# EAGLE design NinjaPCB_ver2-170831 (EAGLE 6.6.0)
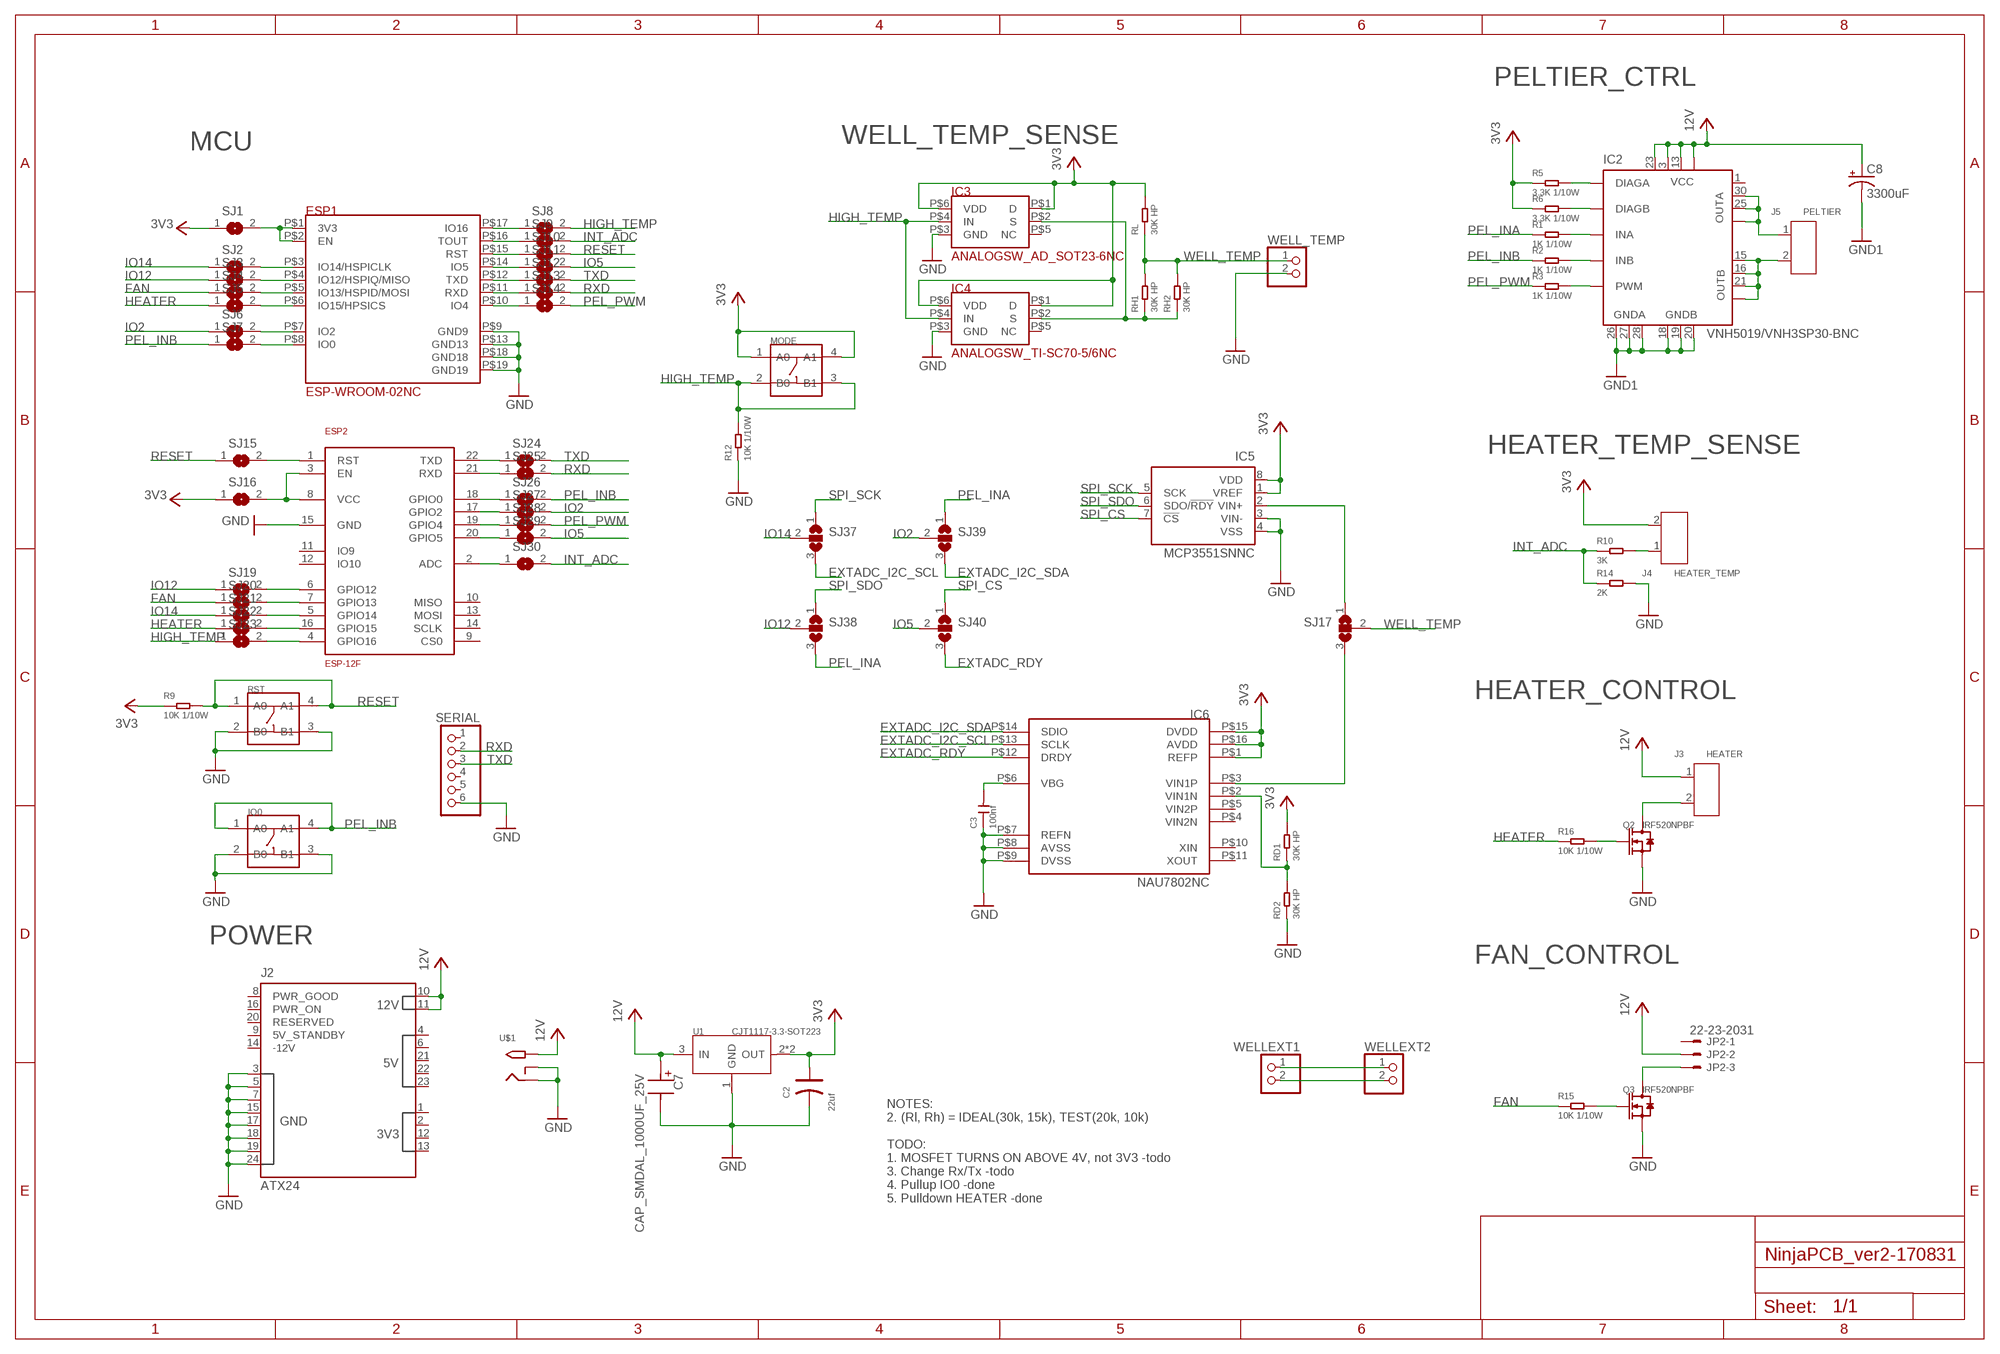
[diagram p0: schematic, sheet 1]

## Parts
C2  22uf  TANTALUM-SMD-22UF-16V(AVX-B)  [AVX-B]
C3  100nf  CERAMIC-100NF-50V-10%-X7R(0603)  [C0603]
C7  CAP_SMDAL_1000UF_25V  [CAP_SMD_AL_D125]
C8  3300uF  CAP_E5-13-L3030RINV  [E5-13-L30R-INV]
ESP1  ESP-WROOM-02NC  [ESP-WROOM-02-NOCREAM]
ESP2  ESP-12F  [ESP-12F]
IC2  VNH5019/VNH3SP30-BNC  [MULTIPOWERSO-30-B-NOCREAM]
IC3  ANALOGSW_AD_SOT23-6NC  [SOT-23-6NC]
IC4  ANALOGSW_TI-SC70-5/6NC  [SC70-6NC]
IC5  MCP3551SNNC  [SO-08-NOCREAM]
IC6  NAU7802NC  [SOP-16NC]
IO0  DIP-SWITCH-TACTILE-SPST-NO/TS-1109(4P-D6.0MM)'TS-1109'  [SW4-6.0X6.0X5.0MM]
J2  ATX24  [ATX24]
J3  HEATER  SCREW-TERMINAL-GREEN(2P-3.5)  [H2-3.5-7.0X7.0MM]
J4  HEATER_TEMP  SCREW-TERMINAL-GREEN(2P-3.5)  [H2-3.5-7.0X7.0MM]
J5  PELTIER  SCREW-TERMINAL-GREEN(2P-3.5)  [H2-3.5-7.0X7.0MM]
JP2  22-23-2031  [22-23-2031]
MODE  DIP-SWITCH-TACTILE-SPST-NO/TS-1109(4P-D6.0MM)'TS-1109'  [SW4-6.0X6.0X5.0MM]
Q2  IRF520NPBF  DIP-MOSFET-N-CH-100V-9.7A-IRF520NPBF(TO-220AB)  [TO-220]
Q3  IRF520NPBF  DIP-MOSFET-N-CH-100V-9.7A-IRF520NPBF(TO-220AB)  [TO-220]
R1  1K 1/10W  SMD-RES-1K-5%-1/10W(0603)  [R0603]
R2  1K 1/10W  SMD-RES-1K-5%-1/10W(0603)  [R0603]
R3  1K 1/10W  SMD-RES-1K-5%-1/10W(0603)  [R0603]
R5  3.3K 1/10W  SMD-RES-3.3K-5%-1/10W(0603)  [R0603]
R6  3.3K 1/10W  SMD-RES-3.3K-5%-1/10W(0603)  [R0603]
R9  10K 1/10W  SMD-RES-10K-5%-1/10W(0603)  [R0603]
R10  3K  SMD-RES-3K-1%-1/10W(0603)  [R0603]
R12  10K 1/10W  SMD-RES-10K-5%-1/10W(0603)  [R0603]
R14  2K  SMD-RES-2K-1%-1/10W(0603)  [R0603]
R15  10K 1/10W  SMD-RES-10K-5%-1/10W(0603)  [R0603]
R16  10K 1/10W  SMD-RES-10K-5%-1/10W(0603)  [R0603]
RD1  30K HP  R0603NC  [R0603NC]
RD2  30K HP  R0603NC  [R0603NC]
RH1  30K HP  R0603NC  [R0603NC]
RH2  30K HP  R0603NC  [R0603NC]
RL  30K HP  R0603NC  [R0603NC]
RST  DIP-SWITCH-TACTILE-SPST-NO/TS-1109(4P-D6.0MM)'TS-1109'  [SW4-6.0X6.0X5.0MM]
SERIAL  PINHD-1X6  [1X06]
SJ1  SJ  [SJ]
SJ2  SJ  [SJ]
SJ3  SJ  [SJ]
SJ4  SJ  [SJ]
SJ5  SJ  [SJ]
SJ6  SJ  [SJ]
SJ7  SJ  [SJ]
SJ8  SJ  [SJ]
SJ9  SJ  [SJ]
SJ10  SJ  [SJ]
SJ11  SJ  [SJ]
SJ12  SJ  [SJ]
SJ13  SJ  [SJ]
SJ14  SJ  [SJ]
SJ15  SJ  [SJ]
SJ16  SJ  [SJ]
SJ17  SJ2W  [SJ_2]
SJ19  SJ  [SJ]
SJ20  SJ  [SJ]
SJ21  SJ  [SJ]
SJ22  SJ  [SJ]
SJ23  SJ  [SJ]
SJ24  SJ  [SJ]
SJ25  SJ  [SJ]
SJ26  SJ  [SJ]
SJ27  SJ  [SJ]
SJ28  SJ  [SJ]
SJ29  SJ  [SJ]
SJ30  SJ  [SJ]
SJ37  SJ2W  [SJ_2]
SJ38  SJ2W  [SJ_2]
SJ39  SJ2W  [SJ_2]
SJ40  SJ2W  [SJ_2]
U1  CJT1117-3.3-SOT223  PMIC-CJT1117-3.3(SOT223)  [SOT-223]
U$1  2.1MMJACKTHM  [PJ-102A]
WELL_TEMP  PINHD-1X2  [1X02]
WELLEXT1  PINHD-1X2  [1X02]
WELLEXT2  PINHD-1X2  [1X02]

## Nets
3V3: C2.+ IC3.P$1(D) IC3.P$6(VDD) IC4.P$1(D) IC4.P$6(VDD) IC5.1(VREF) IC5.8(VDD) IC6.P$1(REFP) IC6.P$15(DVDD) IC6.P$16(AVDD) J4.2 MODE.1(A0) MODE.4(A1) R5.1 R6.1 R9.1 RD1.2 RL.2 SJ1.1 SJ16.1 U1.2(OUT) U1.TER(OUT)
12V: C7.P$P C8.+ IC2.3(VCC) IC2.13(VCC) IC2.23(VCC) IC2.VCC J2.10(12V_10) J2.11(12V_11) J3.1 JP2.2 U1.3(IN) U$1.TIP
EXTADC_I2C_SCL: IC6.P$13(SCLK) SJ37.3
EXTADC_I2C_SDA: IC6.P$14(SDIO) SJ39.3
EXTADC_RDY: IC6.P$12(DRDY) SJ40.3
FAN: R15.1 SJ4.1 SJ20.1
GND: C2.- C3.1 C7.P$M C8.- ESP1.P$9(GND9) ESP1.P$13(GND13) ESP1.P$18(GND18) ESP1.P$19(GND19) ESP2.15(GND) IC2.18(GNDB) IC2.19(GNDB) IC2.20(GNDB) IC2.26(GNDA) IC2.27(GNDA) IC2.28(GNDA) IC3.P$3(GND) IC4.P$3(GND) IC5.3(VIN-) IC5.4(VSS) IC6.P$7(REFN) IC6.P$8(AVSS) IC6.P$9(DVSS) IO0.2(B0) IO0.3(B1) J2.3(GND3) J2.5(GND5) J2.7(GND7) J2.15(GND15) J2.17(GND17) J2.18(GND18) J2.19(GND19) J2.24(GND24) Q2.2(S) Q2.HEAT(S) Q3.2(S) Q3.HEAT(S) R12.1 R14.2 RD2.1 RST.2(B0) RST.3(B1) SERIAL.6 U1.1(GND) U$1.RING U$1.RING_SW WELL_TEMP.2 ; supply symbol labelled GND1
HEATER: R16.1 SJ5.1 SJ22.1
HIGH_TEMP: IC3.P$4(IN) IC4.P$4(IN) MODE.2(B0) MODE.3(B1) R12.2 SJ8.2 SJ23.1
I2C_WELL_TEMP: IC6.P$3(VIN1P) SJ17.3
INT_ADC: R10.1 R14.1 SJ9.2 SJ30.2
IO2: SJ6.1 SJ27.2 SJ39.2
IO5: SJ11.2 SJ29.2 SJ40.2
IO12: SJ3.1 SJ19.1 SJ38.2
IO14: SJ2.1 SJ21.1 SJ37.2
N$1: J4.1 R10.2
N$2: J3.2 Q2.3(D)
N$3: Q2.1(G) R16.2
N$4: JP2.3 Q3.3(D)
N$5: Q3.1(G) R15.2
N$6: IC2.6(DIAGA) R5.2
N$7: IC2.10(DIAGB) R6.2
N$8: IC2.5(INA) R1.2
N$9: IC2.11(INB) R2.2
N$10: IC2.8(PWM) R3.2
N$11: ESP1.P$1(3V3) ESP1.P$2(EN) SJ1.2
N$12: ESP1.P$3(IO14/HSPICLK) SJ2.2
N$13: ESP1.P$4(IO12/HSPIQ/MISO) SJ3.2
N$14: ESP1.P$5(IO13/HSPID/MOSI) SJ4.2
N$15: ESP1.P$6(IO15/HPSICS) SJ5.2
N$16: ESP1.P$7(IO2) SJ6.2
N$17: ESP1.P$8(IO0) SJ7.2
N$18: ESP1.P$17(IO16) SJ8.1
N$19: ESP1.P$16(TOUT) SJ9.1
N$20: ESP1.P$15(RST) SJ10.1
N$21: ESP1.P$14(IO5) SJ11.1
N$22: ESP1.P$12(TXD) SJ12.1
N$23: ESP1.P$11(RXD) SJ13.1
N$24: ESP1.P$10(IO4) SJ14.1
N$26: WELLEXT1.1 WELLEXT2.1
N$27: IC3.P$2(S) IC4.P$2(S) RH1.1 RH2.1
N$28: WELLEXT1.2 WELLEXT2.2
N$40: ESP2.1(RST) SJ15.2
N$42: ESP2.3(EN) ESP2.8(VCC) SJ16.2
N$43: ESP2.22(TXD) SJ24.1
N$44: ESP2.21(RXD) SJ25.1
N$45: ESP2.18(GPIO0) SJ26.1
N$46: ESP2.17(GPIO2) SJ27.1
N$47: ESP2.19(GPIO4) SJ28.1
N$48: ESP2.20(GPIO5) SJ29.1
N$49: ESP2.2(ADC) SJ30.1
N$67: ESP2.6(GPIO12) SJ19.2
N$68: ESP2.7(GPIO13) SJ20.2
N$69: ESP2.5(GPIO14) SJ21.2
N$70: ESP2.16(GPIO15) SJ22.2
N$71: ESP2.4(GPIO16) SJ23.2
N$91: IC6.P$2(VIN1N) RD1.1 RD2.2
N$92: C3.2 IC6.P$6(VBG)
OUTA: IC2.25(OUTA) IC2.30(OUTA) IC2.OUTA J5.1
OUTB: IC2.15(OUTB) IC2.16(OUTB) IC2.21(OUTB) IC2.OUTB J5.2
PEL_INA: R1.1 SJ38.3 SJ39.1
PEL_INB: IO0.1(A0) IO0.4(A1) R2.1 SJ7.1 SJ26.2
PEL_PWM: R3.1 SJ14.2 SJ28.2
RESET: R9.2 RST.1(A0) RST.4(A1) SJ10.2 SJ15.1
RXD: SERIAL.2 SJ13.2 SJ25.2
SPI_CS: IC5.7(!CS) SJ40.1
SPI_SCK: IC5.5(SCK) SJ37.1
SPI_SDO: IC5.6(SDO/!RDY) SJ38.1
SPI_WELL_TEMP: IC5.2(VIN+) SJ17.1
TXD: SERIAL.3 SJ12.2 SJ24.2
WELL_TEMP: RH1.2 RH2.2 RL.1 SJ17.2 WELL_TEMP.1
Unconnected: ESP2.9(CS0) ESP2.10(MISO) ESP2.11(IO9) ESP2.12(IO10) ESP2.13(MOSI) ESP2.14(SCLK) IC2.1(OUTA) IC3.P$5(NC) IC4.P$5(NC) IC6.P$4(VIN2N) IC6.P$5(VIN2P) IC6.P$10(XIN) IC6.P$11(XOUT) J2.1(3V3_1) J2.2(3V3_2) J2.4(5V_4) J2.6(5V_6) J2.8(PWR_GOOD) J2.9(5V_STANDBY) J2.12(3V3_12) J2.13(3V3_13) J2.14(-12V) J2.16(PWR_ON) J2.20(RESERVED) J2.21(5V_21) J2.22(5V_22) J2.23(5V_23) JP2.1 SERIAL.1 SERIAL.4 SERIAL.5

## Notes on the sheet
- PELTIER_CTRL
- MCU | WELL_TEMP_SENSE
- HEATER_TEMP_SENSE
- HEATER_CONTROL
- POWER
- FAN_CONTROL
- NOTES: 
  2. (Rl, Rh) = IDEAL(30k, 15k), TEST(20k, 10k)
  
  TODO:
  1. MOSFET TURNS ON ABOVE 4V, not 3V3 -todo
  3. Change Rx/Tx -todo
  4. Pullup IO0 -done
  5. Pulldown HEATER -done

## Library data of the parts
C2 = Seeed-Capacitor:TANTALUM-SMD-22UF-16V(AVX-B): 302020013; MPN: TAJB226*016#NJ
C3 = Seeed-Capacitor:CERAMIC-100NF-50V-10%-X7R(0603): 302010138; MPN: CC0603KRX7R9BB104
C7 = Seeed-OPL-2017-01-Capacitor-akita:CAP_SMDAL_1000UF_25V: SMD CAP Aluminum 1000uF-25V;D12.5*H13.5mm SKU: 302030098
C8 = PCR-RCL:CAP_E5-13-L30
ESP1 = PCR-Module:ESP-WROOM-02
ESP2 = Seeed-OPL-2017-01-Sensor-camilo:ESP-12F: 317060163
IC2 = st-microelectronics:VNH5019/VNH3SP30-B
IC3 = PCR-IC:ANALOGSW_AD_SOT23-6
IC4 = PCR-IC:ANALOGSW_TI-SC70-5/6
IC5 = microchip:MCP355*: Low-Power, Single-Channel 22-Bit Delta-Sigma ADCs Source: http://ww1.microchip.com/downloads/en/DeviceDoc/21950c.pdf
IC6 = PCR-IC:NAU7802
IO0 MODE RST = Seeed-Switch:DIP-SWITCH-TACTILE-SPST-NO/TS-1109(4P-D6.0MM): 311020024
J2 = PCR-Connector:ATX24
J3-J5 = Seeed-Connector:SCREW-TERMINAL-GREEN(2P-3.5): 320110028; VALUE: GREEN-2P-3.5
JP2 = con-molex:22-23-2031: .100" (2.54mm) Center Header - 3 Pin; MF: MOLEX; MPN: 22-23-2031; OC_FARNELL: 1462950; OC_NEWARK: 30C0862
Q2 Q3 = Seeed-Transistor:DIP-MOSFET-N-CH-100V-9.7A-IRF520NPBF(TO-220AB): 305030059; MPN: IRF520NPBF
R1-R3 = Seeed-Resistor:SMD-RES-1K-5%-1/10W(0603): 301010291; MPN: RC0603JR-071KL
R5 R6 = Seeed-Resistor:SMD-RES-3.3K-5%-1/10W(0603): 301010112
R9 R12 R15 R16 = Seeed-Resistor:SMD-RES-10K-5%-1/10W(0603): 301010293; MPN: RC0603JR-0710KL
R10 = Seeed-Resistor:SMD-RES-3K-1%-1/10W(0603): 301010170; MPN: RC0603FR-073KL
R14 = Seeed-Resistor:SMD-RES-2K-1%-1/10W(0603): 301010221; MPN: RC0603FR-072KL
RD1 RD2 RH1 RH2 RL = PCR-RCL:R0603
SERIAL = pinhead:PINHD-1X6: PIN HEADER
SJ1-SJ16 SJ19-SJ30 = jumper:SJ: SMD solder JUMPER
SJ17 SJ37-SJ40 = jumper:SJ2W: SMD solder JUMPER
U1 = Seeed-IC:PMIC-CJT1117-3.3(SOT223): 310030097; MPN: CJT1117-3.3
U$1 = adafruit:2.1MMJACK: 2.1mm x 5.5mm THM DC jack with internal switch. Digikey part #PJ-102A, 4UCON part #05537 2.1mm x 5.5mm SMT DC jack with internal switch. Digikey part #PJ-002A-SMT, 4UCON part #03267 By microbuilder.eu & adafruit.com
WELL_TEMP WELLEXT1 WELLEXT2 = pinhead:PINHD-1X2: PIN HEADER

## Net classes
1 2A: width 0.406 mm
2 8A: width 2.54 mm

## Board
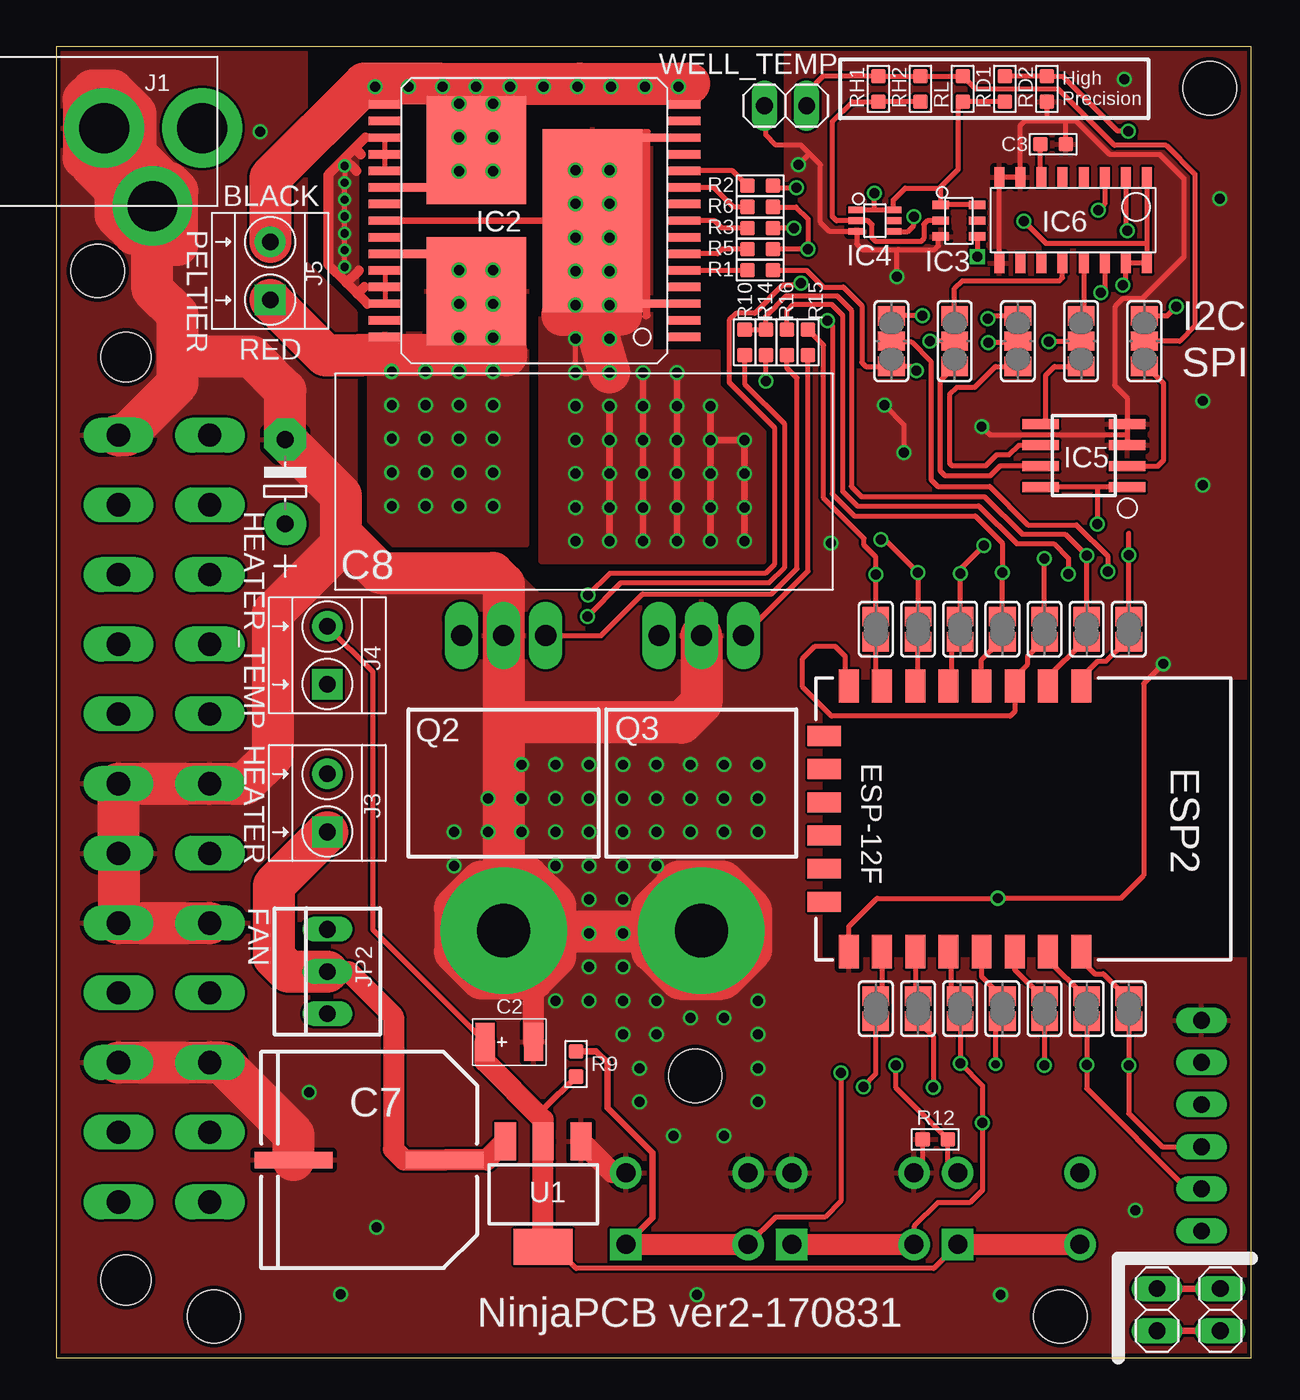
[diagram p1: board, top side]
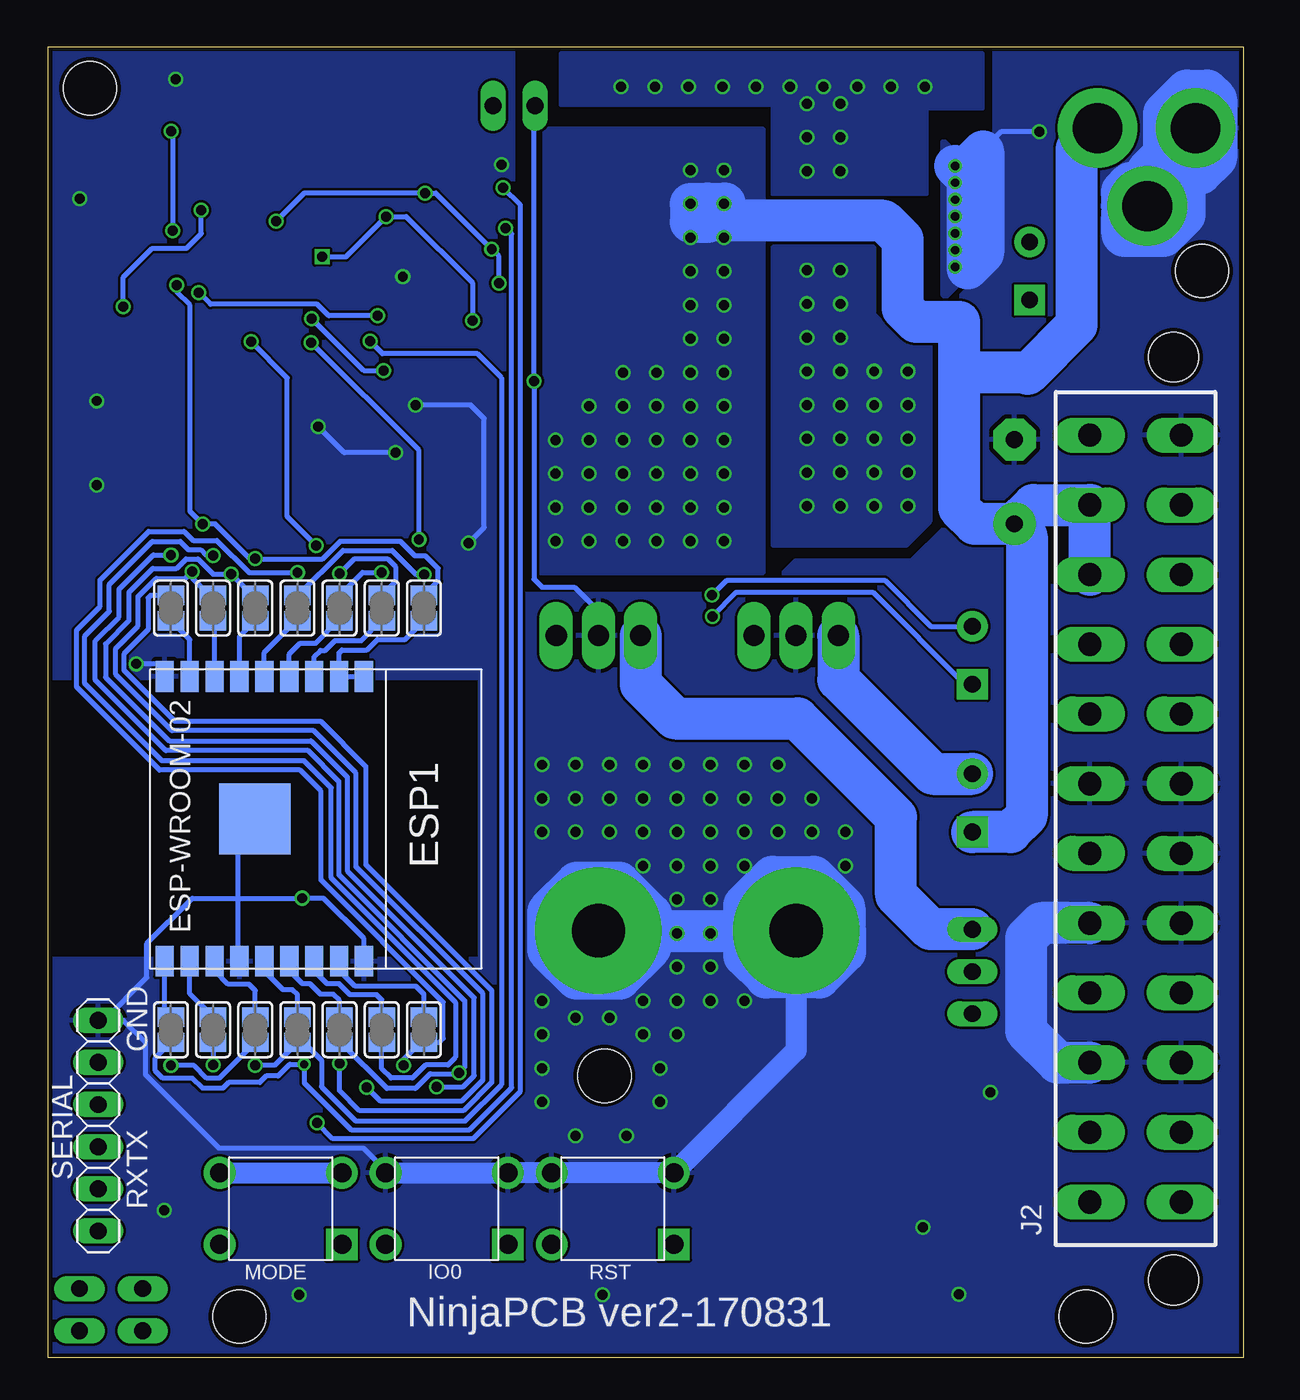
[diagram p2: board, bottom side, seen from below]

Size 72 x 79 mm. Coordinates in mm from the lower left corner, seen from the top.
Outline: 0,79 0,0 72,0 72,79 0,79
Copper layers (1*16): Top 0.035mm / dielectric 1.5mm / Bottom 0.035mm
Design rules "SeeedStudio_2layer_DRU_no_angle_20140221": minimum track width 6mil, minimum drill 12mil, track to track 6mil, track to pad 6mil, pad to pad 6mil, via to via 6mil, smd to smd 0mil, copper to edge 10mil, drill to drill 10mil, minimum pad ring 10mil, minimum via ring 6mil, stop-mask expansion 2mil, vias tented up to drill 100mil, thermal gap 10mil
Holes 3.2 mm at 2.5,65.5 69.5,76.5 60.5,2.5 38.5,17 9.5,2.5

### Footprints (pad centres in the part's own frame; a part is rotated, then mirrored left to right if it is on the bottom)
AVX-B = smd 1.143 x 2.286: + -1.46,0; - 1.46,0
C0603 = smd 0.889 x 0.889: 1 0,0.762; 2 0,-0.762
CAP_SMD_AL_D125 = smd 1 x 4.7: P$M 0,-4.55; P$P 0,4.55
E5-13-L30R-INV = drill 1.016 pad 2.54: + 2.54,0 | drill 1.016 pad 2.54 octagon: - -2.54,0
ESP-WROOM-02-NOCREAM = smd 1.85 x 1.1: P$1 -8.575,12.9; P$2 -8.575,11.4; P$3 -8.575,9.9; P$4 -8.575,8.4; P$5 -8.575,6.9; P$6 -8.575,5.4; P$7 -8.575,3.9; P$8 -8.575,2.4; P$9 -8.575,0.9; P$10 8.575,0.9; P$11 8.575,2.4; P$12 8.575,3.9; P$13 8.575,5.4; P$14 8.575,6.9; P$15 8.575,8.4; P$16 8.575,9.9; P$17 8.575,11.4; P$18 8.575,12.9 | smd 4.3 x 4.3: P$19 0,6.33
ESP-12F = smd 2 x 1.2: 1 -8,3.48; 2 -8,1.48; 3 -8,-0.52; 4 -8,-2.52; 5 -8,-4.52; 6 -8,-6.52; 7 -8,-8.52; 8 -8,-10.52; 15 8,-10.52; 16 8,-8.52; 17 8,-6.52; 18 8,-4.52; 19 8,-2.52; 20 8,-0.52; 21 8,1.48; 22 8,3.48 | smd 1.2 x 2: 9 -5,-12; 10 -3,-12; 11 -1,-12; 12 1,-12; 13 3,-12; 14 5,-12
MULTIPOWERSO-30-B-NOCREAM = smd 0.508 x 2: 1 -7,-9; 2 -6,-9; 4 -4,-9; 5 -3,-9; 6 -2,-9; 7 -1,-9; 8 0,-9; 9 1,-9; 10 2,-9; 11 3,-9; 12 4,-9; 14 6,-9; 15 7,-9; 16 7,9; 17 6,9; 18 5,9; 19 4,9; 20 3,9; 22 1,9; 23 0,9; 24 -1,9; 26 -3,9; 27 -4,9; 28 -5,9; 29 -6,9; 30 -7,9 | smd 0.508 x 4: 3 -5,-8; 13 5,-8; 21 2,8; 25 -2,8 | smd 6.5 x 6: OUTA -4.25,3.5; OUTB 4.25,3.5 | smd 11 x 6: VCC 0,-3.5
SOT-23-6NC = smd 0.5 x 1: P$1 -0.95,-1.1; P$2 0,-1.1; P$3 0.95,-1.1; P$4 0.95,1.1; P$5 0,1.1; P$6 -0.95,1.1
SC70-6NC = smd 0.4 x 1: P$1 -0.65,-1.1; P$2 0,-1.1; P$3 0.65,-1.1; P$4 0.65,1.1; P$5 0,1.1; P$6 -0.65,1.1
SO-08-NOCREAM = smd 0.6 x 2.2: 1 -1.905,-2.6; 2 -0.635,-2.6; 3 0.635,-2.6; 4 1.905,-2.6; 5 1.905,2.6; 6 0.635,2.6; 7 -0.635,2.6; 8 -1.905,2.6
SOP-16NC = smd 0.6 x 1.2: P$1 -4.445,-2.6; P$2 -3.175,-2.6; P$3 -1.905,-2.6; P$4 -0.635,-2.6; P$5 0.635,-2.6; P$6 1.905,-2.6; P$7 3.175,-2.6; P$8 4.445,-2.6; P$9 4.445,2.6; P$10 3.175,2.6; P$11 1.905,2.6; P$12 0.635,2.6; P$13 -0.635,2.6; P$14 -1.905,2.6; P$15 -3.175,2.6; P$16 -4.445,2.6
SW4-6.0X6.0X5.0MM = drill 1.143 pad 1.905 square: 1 -3.683,2.159 | drill 1.143 pad 1.905: 2 -3.683,-2.159; 3 3.683,-2.159; 4 3.683,2.159
ATX24 = drill 1.4 long: 1 23.1,-2.75; 2 18.9,-2.75; 3 14.7,-2.75; 4 10.5,-2.75; 5 6.3,-2.75; 6 2.1,-2.75; 7 -2.1,-2.75; 8 -6.3,-2.75; 9 -10.5,-2.75; 10 -14.7,-2.75; 11 -18.9,-2.75; 12 -23.1,-2.75; 13 23.1,2.75; 14 18.9,2.75; 15 14.7,2.75; 16 10.5,2.75; 17 6.3,2.75; 18 2.1,2.75; 19 -2.1,2.75; 20 -6.3,2.75; 21 -10.5,2.75; 22 -14.7,2.75; 23 -18.9,2.75; 24 -23.1,2.75 | hole 3: 27.8,2.29; -27.8,2.29
H2-3.5-7.0X7.0MM = drill 1 pad 1.85 square: 1 -1.75,0 | drill 1 pad 1.85: 2 1.75,0
22-23-2031 = drill 1 long: 1 -2.54,0; 2 0,0; 3 2.54,0
TO-220 = drill 1.27 pad 2.032 long: 1 -2.54,-11.43; 2 0,-11.43; 3 2.54,-11.43 | drill 3.2 pad 7.62: HEAT 0,6.35
R0603 = smd 0.889 x 0.889: 1 0,0.762; 2 0,-0.762
R0603NC = smd 0.889 x 0.889: 1 0,0.762; 2 0,-0.762
1X06 = drill 1.016 long: 1 -6.35,0; 2 -3.81,0; 3 -1.27,0; 4 1.27,0; 5 3.81,0; 6 6.35,0
SJ = smd 1.168 x 1.6: 1 -0.762,0; 2 0.762,0
SJ_2 = smd 1.168 x 1.6: 1 -1.524,0; 2 0,0; 3 1.524,0
SOT-223 = smd 1.27 x 2.286: 1 -2.286,-3.175; 2 0,-3.175; 3 2.286,-3.175 | smd 3.556 x 2.159: TER 0,3.175
PJ-102A = drill 3 pad 4.8: RING 0.1,-3.39; RING_SW -4.6,-6.29; TIP 0.1,-9.29
1X02 = drill 1.016 long: 1 -1.27,0; 2 1.27,0

### Placement (x,y rotation side)
C2  27.29,19.03 0 top
C3  60.06,73.12 270 top
C7  18.85,11.93 270 top
C8  13.79,52.8 270 top
ESP1  65.89,32.48 270 bottom
ESP2  58.27,32.48 270 top
IC2  VNH3SP30-BNC  [MULTIPOWERSO-30-B-NOCREAM]  28.81,68.52 90 top
IC3  54.38,68.52 270 top
IC4  49.33,68.52 270 top
IC5  61.91,54.36 90 top
IC6  61.26,68.55 180 top
IO0  48,9 180 bottom
J2  6.5,32.5 270 bottom
J3  16.33,33.44 90 top
J4  16.33,42.33 90 top
J5  12.89,65.49 90 top
JP2  16.33,23.28 90 top
MODE  58,9 180 bottom
Q2  26.95,32.1 180 top
Q3  38.86,32.1 180 top
R1  42.42,65.54 270 top
R2  42.42,70.62 270 top
R3  42.42,68.08 270 top
R5  42.42,66.81 270 top
R6  42.42,69.35 270 top
R9  31.32,17.71 180 top
R10  41.48,61.19 0 top
R12  52.96,13.16 90 top
R14  42.75,61.19 0 top
R15  45.29,61.19 0 top
R16  44.02,61.19 0 top
RD1  57.15,76.46 0 top
RD2  59.69,76.46 180 top
RH1  49.53,76.46 180 top
RH2  52.07,76.46 180 top
RL  54.61,76.46 0 top
RST  38,9 180 bottom
SERIAL  69,14 90 bottom
SJ1  49.38,45.18 270 bottom
SJ2  51.92,45.18 270 bottom
SJ3  54.46,45.18 270 bottom
SJ4  57,45.18 270 bottom
SJ5  59.54,45.18 270 bottom
SJ6  62.08,45.18 270 bottom
SJ7  64.62,45.18 270 bottom
SJ8  49.38,19.78 270 bottom
SJ9  51.92,19.78 270 bottom
SJ10  54.46,19.78 270 bottom
SJ11  57,19.78 270 bottom
SJ12  59.54,19.78 270 bottom
SJ13  62.08,19.78 270 bottom
SJ14  64.62,19.78 270 bottom
SJ15  64.62,43.91 270 top
SJ16  59.54,43.91 270 top
SJ17  65.56,61.26 90 top
SJ19  51.92,43.91 270 top
SJ20  49.38,43.91 270 top
SJ21  54.46,43.91 270 top
SJ22  49.38,21.05 90 top
SJ23  57,43.91 270 top
SJ24  64.62,21.05 270 top
SJ25  62.08,21.05 270 top
SJ26  54.46,21.05 270 top
SJ27  51.92,21.05 270 top
SJ28  57,21.05 270 top
SJ29  59.54,21.05 270 top
SJ30  62.08,43.91 90 top
SJ37  61.74,61.26 90 top
SJ38  57.94,61.26 90 top
SJ39  50.31,61.26 90 top
SJ40  54.12,61.26 90 top
U1  29.34,9.87 180 top
U$1  -0.5,74 90 top
WELL_TEMP  43.94,75.44 180 top
WELLEXT1  66.32,2.91 90 top
WELLEXT2  70.13,2.91 90 top

### Tracks (layer width: path | path; a pad name or v marks a point on that pad's centre or on a via)
3V3  (via drill 0.6)
  Top 0.305: SJ16.1 v59.54,48.17 | MODE.1 52.87,5.39 31.32,5.39 30.01,6.7 U1.TER | IC5.8 IC5.1 62.71,52.46 v62.71,50.25 | IC6.P$1 65.71,67.16 | 65.71,67.16 IC6.P$16 IC6.P$15 64.44,64.82 v64.26,64.65 | RD1.2 RL.2 54.33,75.41 54.33,71.6 53.21,70.49 | 43.2,66.78 R5.1 v45.29,66.81 45.29,68.64 44.58,69.35 R6.1 | 49.3,69.17 IC4.P$6 50.43,69.77 51.16,70.49 53.21,70.49 | IC4.P$1 49.3,69.17 | v44.86,64.75 44.73,64.62 43.76,64.62 42.09,62.95 40.97,62.95 40.54,62.52 40.54,58.78 43.26,56.06 43.26,47.81 42.72,47.27 33.35,47.27 v32.03,45.95 | 29.39,13.92 29.34,13.92 | C2.+ 19.07,25.79 19.07,41.34 J4.2 | v58.29,68.48 59.61,67.16 65.71,67.16 | 29.34,13.83 U1.2 | 53.21,70.49 53.28,70.42 IC3.P$1 IC3.P$6 | 49.3,69.17 v49.3,70.19
  Top 0.406: R9.1 29.34,14.97 U1.2
  Top 1.27: U1.TER U1.2 29.34,13.92 29.34,14.36 25.83,17.86 C2.+ | MODE.1 MODE.4
  Bottom 0.305: SJ1.1 48.52,46.8 48.52,47.56 49.29,48.34 49.94,48.34 50.81,49.22 54.41,49.22 55.51,48.11 59.48,48.11 v59.54,48.17 59.88,48.17 61.95,50.25 v62.71,50.25 63.48,51.01 63.48,63.43 64.26,64.22 v64.26,64.65 | v44.86,64.75 44.86,66.38 v45.29,66.81 48.67,70.19 v49.3,70.19 56.59,70.19 v58.29,68.48 | v32.03,45.95 31.11,46.87 21.61,46.87 18.83,44.08 J4.2
12V  (via drill 0.6)
  Top 0.305: IC2.VCC v33.32,59.38 | v33.32,71.57 32.31,73.52 IC2.13 | v33.32,71.57 IC2.VCC | IC2.VCC v31.29,65.47 | v31.29,65.47 32.31,69.07 | IC2.VCC v31.29,67.5 v31.29,69.54 v31.29,71.57 31.29,73.89 35.43,73.89 | v33.32,71.57 v33.32,69.54 | v33.32,69.54 v33.32,65.47 | v31.29,65.47 v33.32,69.54 | v33.32,67.5 v33.32,69.54 | v33.32,59.38 v31.29,59.38 v31.29,61.41 | v33.32,59.38 v33.32,61.41 v31.29,63.44 | 32.51,64.46 v33.32,63.44 32.31,63.52 32.51,63.52 | 32.51,64.46 32.51,68.84 | 32.51,63.52 32.51,64.46 | 32.51,63.52 IC2.3 | 35.43,73.89 35.46,73.89 | 35.46,73.89 35.46,62.74 35.59,62.74 35.59,62.77 35.66,62.77 35.66,73.89 35.46,73.89 | 35.43,73.89 35.43,71.56 33.33,71.56
  Top 0.406: IC2.23 IC2.VCC | v33.32,57.34 v33.32,55.31 v33.32,53.28 v33.32,51.25 v33.32,49.22 | v35.35,49.22 v35.35,51.25 v35.35,53.28 v35.35,55.31 v35.35,57.34 v35.35,59.38 | v37.39,59.38 v37.39,57.34 v37.39,55.31 v37.39,53.28 v37.39,51.25 v37.39,49.22 | v39.42,49.22 v39.42,51.25 v39.42,53.28 v39.42,55.31 | v39.42,55.31 v39.42,57.34 | v39.42,55.31 v41.45,55.31 v41.45,53.28 v41.45,51.25 v41.45,49.22
  Top 1.27: U1.3 25.94,11.93 C7.P$P 20.97,11.93 20.32,12.58 20.32,20.58 17.62,23.28 JP2.2
  Top 2.54: J3.1 13.11,28.46 13.11,24.16 13.98,23.28 JP2.2 | 32.31,69.07 IC2.VCC 32.31,69.53 31.27,69.53 | v33.32,59.38 32.31,62.85 30.48,62.85 30.48,62.87 34.04,62.87 34.04,64.42 32.31,64.42
  Bottom 2.54: J2.10 J2.11 12.65,51.4 C8.+ | C8.+ 13.06,49.52 13.06,32.67 14.03,31.69 J3.1 | 17.14,59.37 17.14,62.41 19.71,62.41 20.52,63.23 20.52,67.38 21.67,68.52 IC2.VCC 32.31,69.53 33.3,69.53 33.3,68.46 32.28,68.46 32.28,69.55 31.24,69.55 | 17.14,59.37 17.14,51.21 16.19,50.26 C8.+ | U$1.TIP 10.06,72.83 10.06,62.24 13.01,59.29 13.08,59.37 17.14,59.37
  other vias: 31.29,57.34 31.29,55.31 31.29,53.28 31.29,51.25 31.29,49.22
  pour Top: 35.81,74.02 35.81,60.64 39.88,60.64 39.88,58.55 42.62,55.81 42.62,47.96 29.21,47.96 29.21,74.02
  pour Bottom: 28.96,74.05 28.96,47.3 42.34,47.3 42.34,58.2 42.09,58.45 42.09,74.05
EXTADC_I2C_SCL
  Top 0.305: IC6.P$13 61.9,62.94 SJ37.3
EXTADC_I2C_SDA  (via drill 0.6)
  Top 0.305: IC6.P$14 63.17,64.42 v62.94,64.19 | v52.17,62.8 50.33,62.8 SJ39.3
  Bottom 0.305: v52.17,62.8 55.12,62.8 55.8,63.48 62.23,63.48 v62.94,64.19
EXTADC_RDY
  Top 0.305: SJ40.3 54.12,64.44 54.59,64.9 60.45,64.9 60.63,65.08 IC6.P$12
FAN  (via drill 0.6)
  Top 0.305: SJ20.1 v49.38,47.21 49.38,48.26 48.67,48.98 48.67,49.38 46.23,51.82 46.23,61.02 R15.1
  Bottom 0.305: SJ4.1 56.98,45.94 54.26,48.66 51.28,48.66 49.84,47.21 v49.38,47.21
GND  (via drill 0.5, 0.6)
  Top 0.305: 47.75,24.19 ESP2.15 47.75,26 49.46,27.7 v56.72,27.7 64.14,27.7 65.51,29.07 65.51,40.63 v66.7,41.83 | v17.38,65.73 v17.38,66.74 v17.38,67.76 v17.38,68.77 v17.38,69.79 v17.38,70.81 v17.38,71.82 17.38,72.23 17.35,72.25 | IO0.3 52.2,11.67 R12.1 | IC6.P$9 56.82,70.59 | 56.82,70.59 IC6.P$8 IC6.P$7 58.09,74.28 58.33,74.52 59.54,74.52 | 53.19,67.57 IC3.P$3 53.16,67.45 53.16,67.01 52.93,66.78 50.72,66.78 | v42.75,58.86 R14.2 | 64.52,55.71 IC5.4 64.52,57.84 63.75,58.6 63.78,58.63 63.78,63.33 64.26,63.81 65.43,63.81 67.94,66.33 67.94,71.05 66.47,72.52 63.45,72.52 61.45,74.52 60.81,74.52 | 64.52,55.71 IC5.3 | 56.74,70.67 56.82,70.59 | 23.9,48.19 24.03,48.06 25.53,48.06 26.29,47.3 | v55.75,56.11 56.24,55.63 64.44,55.63 64.52,55.71 | IC2.26 IC2.27 IC2.28 18.74,63.52 | IC2.20 IC2.19 IC2.18 18.62,73.52 | v49.89,57.41 51.08,56.22 v51.08,54.54 | 60.81,74.52 59.54,74.52 | C3.1 60.82,74.5 60.81,74.52 | RD2.1 59.69,74.67 59.54,74.52 | 45.38,72.56 46.05,71.89 46.05,68.41 46.59,67.87 IC4.P$3 48.23,67.12 48.56,66.78 50.72,66.78 | 45.38,72.56 44.86,73.08 43.36,73.08 42.75,73.69 42.75,75.37 WELL_TEMP.2 | v50.65,65.16 50.65,66.71 50.72,66.78 | v44.7,71.89 45.38,72.56
  Top 0.406: v28.04,35.74 26.95,34.73 26.95,35.06
  Top 0.61: 18.62,73.52 17.99,72.89 | 17.99,72.89 17.35,72.25 | 17.35,72.25 16.39,71.29 16.39,65.88 17.49,64.77 | 17.49,64.77 18.15,64.11 | 18.15,64.11 18.74,63.52 | 18.35,72.52 17.99,72.89 | 18.08,71.52 17.35,72.25 | 18.56,64.52 18.15,64.11 | 18.24,65.52 17.49,64.77
  Top 1.27: RST.2 33.51,11.16 U1.1 | C2.- 28.75,23.94 Q2.HEAT
  Top 2.54: C7.P$M 14.3,13.47 9.97,17.8 J2.3 J2.15 | J2.24 4.21,55.6 7.32,58.7 7.32,60.56 | 7.32,60.56 7.32,62.88 5.79,64.4 5.79,67.06 7.29,67.06 7.29,70.31 6.81,70.8 6.5,70.8 4.78,72.52 4.78,74.99 3.4,76.36 2.18,76.36 1.65,75.83 1.65,72.29 2.74,73.39 2.74,75.65 2.12,75.03 2.12,71.82 5.33,68.61 5.33,68.31 3.96,69.68 3.56,69.68 3.56,68.86 4.69,67.73 4.69,68.3 U$1.RING_SW | 7.32,60.56 7.54,60.33 11.76,60.33 13.79,58.3 C8.- 17.14,51.99 17.14,49.66 17.46,49.35 | J2.5 J2.17 J2.18 J2.19 J2.7 11.35,34.6 13.06,36.3 13.06,44.91 17.46,49.32 17.46,49.35 | Q2.2 26.95,43.03 | 26.95,43.03 26.95,38.18 | 26.95,38.18 26.95,35.06 Q2.HEAT 25.86,25.75 25.86,25 28.19,25 28.19,26.04 25.6,26.04 25.6,28.68 24.03,27.11 24.03,24.47 25.63,22.87 28.73,22.87 30.07,24.21 30.07,27.26 28.37,28.96 26.85,28.96 26.85,25.69 37.39,25.69 37.39,28.48 37.41,28.48 | Q3.2 38.86,39.45 37.69,38.28 27.05,38.28 26.95,38.18 | 17.46,49.35 19.51,47.3 26.29,47.3 26.95,46.64 26.95,43.04 26.95,43.03 | 38.48,28.48 37.41,28.48 | 37.41,28.48 35.92,26.98 35.92,24.52 37.59,22.84 40.13,22.84 41.88,24.59 41.88,26.95 40.16,28.68 37.52,28.68 37.29,28.45 37.29,27.32 | Q3.HEAT 38.18,25.06 38.18,24.47 38.33,24.62 40.21,24.62 39.42,25.41 39.42,27.29 39.4,27.26 37.19,27.26 38.43,26.02 38.79,26.02 37.52,27.29 37.36,27.29
  Bottom 0.305: ESP1.P$13 60.56,23.97 60.56,27.7 | ESP1.P$19 59.59,32.5 | ESP1.P$18 52.99,25.27 55.42,27.7 v56.72,27.7 | 60.51,31.53 ESP1.P$19 | ESP1.P$9 64.99,41.83 v66.7,41.83 | 60.56,27.7 v56.72,27.7 | 60.56,27.7 60.56,32.48 ESP1.P$19 | IO0.3 51.68,11.3 53.03,12.66 61.75,12.66 66.17,17.08 66.17,19.03 67.49,20.35 SERIAL.6 68.63,20.35 66.06,22.92 66.06,24.97 63.34,27.7 v56.72,27.7 | Q3.2 38.86,44.99 40.31,46.44 42.27,46.44 42.75,46.92 v42.75,58.86 42.75,75.37 WELL_TEMP.2 | v51.08,54.54 54.18,54.54 v55.75,56.11 | v46.69,49.1 45.74,50.04 45.74,56.6 46.56,57.41 v49.89,57.41 | v12.29,73.87 14.61,73.87 16.79,71.69
  Bottom 1.27: IO0.3 IO0.2 RST.3 RST.2 26.95,18.52 26.95,25.46 27.03,25.53
  Bottom 2.54: J2.5 12.19,26.2 13.11,25.28 13.11,19.72 11.19,17.8 J2.3 | Q2.HEAT 24,25.75 24,24.49 25.58,22.92 28.75,22.92 30.07,24.24 30.07,25.79 30.18,25.69 | 30.18,25.69 35.59,25.69 | 35.59,25.69 35.69,25.79 35.69,26.7 37.62,28.63 40.16,28.63 41.88,26.91 41.88,24.57 40.18,22.87 37.59,22.87 35.74,24.72 35.74,26.73 35.81,26.65 39.98,26.65 40.08,26.55 40.08,24.75 39.85,24.52 37.29,24.52 36.12,25.69 35.59,25.69 | 30.18,25.69 27.58,25.69 26.87,26.4 | 26.87,26.4 26.87,26.91 | 26.87,26.4 26.87,24.11 29.79,27.03 30.07,27.03 30.07,27.29 28.37,28.99 25.88,28.99 24.05,27.16 24.05,25.99 26.57,25.99 27.03,25.53 | 16.79,71.69 16.68,71.69 15.67,72.7 15.67,66.59 16.61,65.66 16.61,71.05 v17.38,71.82 | U$1.RING_SW 7.32,69.4 7.32,70.29 6.81,70.8 5.36,70.8 5.74,71.18 5.74,71.56 4.78,72.52 4.78,74.99 3.4,76.36 2.18,76.36 1.65,75.83 1.65,72.29 2.59,71.36 3.89,71.36 3.56,71.02 3.56,68.86 4.83,67.59 7.19,67.59 7.29,67.7 7.29,69.14 2.89,73.55 U$1.RING
  other vias: 30.07,35.74 32.11,35.74 34.14,35.74 34.14,33.71 32.11,33.71 30.07,33.71 28.04,33.71 26.01,33.71 23.98,31.68 26.01,31.68 28.04,31.68 30.07,31.68 32.11,31.68 34.14,31.68 34.14,29.65 32.11,29.65 23.98,29.65 30.07,29.65 36.17,29.65 34.14,27.62 32.11,27.62 32.11,25.58 34.14,25.58 32.11,23.55 34.14,23.55 32.11,21.52 30.07,21.52 34.14,21.52 36.17,21.52 35.15,15.42 34.14,19.49 36.17,19.49 38.2,20.5 40.23,20.5 42.27,21.52 42.27,19.49 35.15,17.46 42.27,17.46 42.27,15.42 40.23,13.39 37.19,13.39 17.14,3.83 19.3,7.88 15.24,16.01 38.61,3.82 56.9,3.82 65.02,8.9 69.09,52.58 69.09,57.66 64.34,77.04 70.1,69.86 36.17,35.74 38.2,35.74 40.23,35.74 42.27,35.74 36.17,33.71 38.2,33.71 40.23,33.71 42.27,33.71 36.17,31.68 38.2,31.68 40.23,31.68 42.27,31.68
  pour Top: 18.14,72.84 18.14,64.46 16.61,65.98 16.61,71.31
  pour Bottom: 0,79 15,79 15,66 18,63 18,50 20,48 27,48 29,46 44,46 44,79 72,79 72,41 46,41 46,24 72,24 72,0 0,0
  pour Top: 0,79 15,79 15,66 18,63 18,50 20,48 27,48 29,46 44,46 44,79 72,79 72,41 46,41 46,24 72,24 72,0 0,0
  pour Bottom: 18.14,73.26 18.14,64.09 17.96,63.91 16.1,65.77 16.1,71.38 17.98,73.26
HEATER  (via drill 0.6)
  Top 0.305: v48.62,16.35 49.38,17.11 SJ22.1 | R16.1 44.02,63.07 44.42,63.48 46.71,63.48 47.37,62.82 47.37,52.23 48.26,51.34 55.58,51.34 57.86,49.05 60.1,49.05 60.98,48.16 v60.98,47.23
  Bottom 0.305: v48.62,16.35 47.01,16.35 46.35,17 46.35,21.7 54,29.35 54,34.99 56.19,37.18 64.72,37.18 68.56,41.01 68.56,43.02 67.16,44.41 67.16,46.12 65.71,47.56 64.28,47.56 63.7,48.14 62.99,48.14 62.08,47.23 v60.98,47.23 59.7,45.94 SJ5.1
HIGH_TEMP  (via drill 0.6)
  Top 0.305: SJ23.1 v57,47.31 57,49.1 55.37,50.73 48.08,50.73 46.76,52.05 46.76,62.19 v46.46,62.49 | MODE.2 53.72,11.75 R12.2 50.6,16.29 v50.6,17.63 | IC4.P$4 51.3,67.87 51.66,68.23 v51.66,68.76 | IC3.P$4 55.48,66.37 v55.5,66.35
  Bottom 0.305: v50.6,17.63 50.6,17.99 49.57,19.02 SJ8.2 48.44,19.02 48.21,19.24 48.21,21.43 55.58,28.79 55.58,34.15 56.85,35.42 65.31,35.42 70.31,40.43 70.31,43.86 68.89,45.28 68.89,46.88 65.97,49.8 63.83,49.8 63.29,49.26 61.85,49.26 59.9,47.31 v57,47.31 | v55.5,66.35 54.08,66.35 v51.66,68.76 50.44,68.76 46.46,64.78 v46.46,62.49
  Bottom 1.27: MODE.3 MODE.2
I2C_WELL_TEMP  (via drill 0.6)
  Top 0.305: SJ17.3 66.94,62.78 v67.49,63.33 | IC6.P$3 63.17,69.53 v62.79,69.14
  Bottom 0.305: v67.49,63.33 67.49,65.11 65.73,66.86 63.68,66.86 62.79,67.75 v62.79,69.14
INT_ADC  (via drill 0.6)
  Top 0.305: SJ30.2 v62.08,48.35 60.8,49.64 58.19,49.64 55.93,51.9 48.51,51.9 47.9,52.51 47.9,63.12 47.04,63.99 43.99,63.99 42.75,62.74 R14.1 R10.1
  Bottom 0.305: 51.69,19.02 SJ9.2 51.92,17.43 51.36,16.87 50.06,16.87 49.28,17.66 47.93,17.66 47.47,18.12 47.47,21.43 54.97,28.92 54.97,34.36 56.59,35.98 65.15,35.98 69.8,40.63 69.8,43.5 68.33,44.97 68.33,46.6 65.74,49.19 64.06,49.19 63.57,48.7 62.84,48.7 62.49,48.35 v62.08,48.35
IO2  (via drill 0.6)
  Top 0.305: SJ27.2 52.83,19.37 v52.83,16.31 | SJ39.2 50.27,61.22 51.51,61.22 52.7,60.03 52.7,52.91 53.11,52.51 56.24,52.51 58.55,50.2 61.47,50.2 63.35,48.32 v63.35,47.38
  Bottom 0.305: v52.83,16.31 52.02,15.5 47.07,15.5 45.82,16.74 45.82,21.95 53.47,29.6 53.47,35.24 56.03,37.8 64.57,37.8 67.94,41.18 67.94,42.75 66.6,44.1 66.6,45.88 65.51,46.97 63.75,46.97 v63.35,47.38 63.35,47 62.61,46.26 62.4,46.26 SJ6.1 62.14,45.94
IO5  (via drill 0.6)
  Top 0.305: SJ29.2 v59.54,17.64 | SJ40.2 v52.64,61.26 v52.63,61.27
  Bottom 0.305: SJ11.2 57.18,19.02 | v59.54,17.64 58.37,17.64 SJ11.2 | SJ11.2 56.63,19.02 55.55,17.94 55.55,16.34 53.49,14.28 46.89,14.28 44.7,16.47 44.7,59.06 46.15,60.51 51.87,60.51 v52.63,61.27
IO12  (via drill 0.6)
  Top 0.305: SJ38.2 57.84,61.17 v56.16,61.17 | v51.92,47.33 SJ19.1 | v51.92,47.33 51.92,47.38 | v51.92,47.33 49.94,49.31 v49.68,49.31
  Bottom 0.305: SJ3.1 53.07,47.33 v51.92,47.33 | v49.68,49.31 49.68,54.69 v56.16,61.17
IO14  (via drill 0.6)
  Top 0.305: SJ21.1 v54.46,47.26 54.46,47.53 v55.88,48.95 | SJ37.2 61.7,61.22 v59.79,61.22
  Bottom 0.305: SJ2.1 51.06,46.8 51.06,47.64 51.54,48.12 53.6,48.12 v54.46,47.26 | v59.79,61.22 57.61,59.04 57.61,50.68 v55.88,48.95
N$1  (via drill 0.6)
  Top 0.305: R10.2 41.48,58.68 43.87,56.29 43.87,47.61 42.95,46.69 34.01,46.69 v32,44.69
  Bottom 0.305: v32,44.69 30.56,46.13 22.33,46.13 16.78,40.58 J4.1
N$2
  Bottom 2.54: Q2.3 24.41,40.88 18.73,35.19 J3.2
N$3
  Top 0.305: Q2.1 32.83,43.53 35.33,46.03 43.1,46.03 44.63,47.55 44.63,59.04 44.02,59.64 R16.2
N$4
  Bottom 2.54: Q3.3 36.32,40.6 34.27,38.54 26.87,38.54 20.93,32.59 20.93,27.9 18.86,25.82 JP2.3
N$5
  Top 0.305: Q3.1 45.29,47.41 R15.2
N$6
  Top 0.305: R5.2 40.13,66.81 39.84,66.52 IC2.6
N$7
  Top 0.305: R6.2 40.79,69.35 39.62,70.52 IC2.10
N$8
  Top 0.305: R1.2 41.64,65.52 IC2.5
N$9
  Top 0.305: R2.2 40.75,71.52 IC2.11
N$10
  Top 0.305: R3.2 40.11,68.08 39.66,68.52 IC2.8
N$11
  Bottom 0.305: SJ1.2 50.5,43.3 52.17,43.3 52.81,42.66 54.31,42.66 54.49,42.48 ESP1.P$2 ESP1.P$1
N$12
  Bottom 0.305: ESP1.P$3 55.99,42.25 55.6,42.64 55.32,42.64 54.74,43.22 53.14,43.22 51.95,44.41 SJ2.2
N$13
  Bottom 0.305: ESP1.P$4 57.49,42.4 56.82,43.07 55.88,43.07 54.54,44.41 SJ3.2
N$14
  Bottom 0.305: ESP1.P$5 58.99,42.5 57.08,44.41 SJ4.2
N$15
  Bottom 0.305: ESP1.P$6 60.49,43.47 SJ5.2
N$16
  Bottom 0.305: ESP1.P$7 61.99,44.33 SJ6.2
N$17
  Bottom 0.305: ESP1.P$8 63.49,43.28 SJ7.2
N$18
  Bottom 0.305: SJ8.1 49.38,21.91 49.86,22.39 53.52,22.39 54.49,23.36 ESP1.P$17
N$19
  Bottom 0.305: SJ9.1 51.92,21.58 52.23,21.89 53.83,21.89 54.48,22.55 55.22,22.55 55.99,23.31 ESP1.P$16
N$20
  Bottom 0.305: SJ10.1 54.46,21.53 54.84,21.91 55.6,21.91 56.24,22.55 56.7,22.55 57.49,23.34 ESP1.P$15
N$21
  Bottom 0.305: SJ11.1 57,21.89 57.3,22.19 57.86,22.19 58.99,23.32 ESP1.P$14
N$22
  Bottom 0.305: SJ12.1 59.54,22.14 59.92,22.52 61.17,22.52 61.99,23.34 ESP1.P$12
N$23
  Bottom 0.305: SJ13.1 63.49,21.95 ESP1.P$11
N$24
  Bottom 0.305: SJ14.1 64.99,20.91 ESP1.P$10
N$26
  Top 0.406: WELLEXT1.1 WELLEXT2.1
N$27
  Top 0.305: IC3.P$2 52.49,68.52 52.27,68.31 52.27,67.44 52.09,67.27 49.38,67.27 49.15,67.49 49.15,68.28 48.91,68.52 IC4.P$2 47.01,68.52 46.76,68.76 46.76,74.5 47.95,75.7 RH1.1 RH2.1
N$28
  Top 0.406: WELLEXT1.2 WELLEXT2.2
N$40
  Top 0.305: ESP2.1 61.75,40.99 62.74,41.98 63.25,41.98 64.42,43.15 SJ15.2
N$42
  Top 0.305: SJ16.2 59.39,43.15 58.52,42.28 58.52,41.83 57.75,41.05 ESP2.3 57.75,38.94 57.48,38.67 46.71,38.67 44.96,40.43 44.96,42.13 45.72,42.89 46.92,42.89 47.53,42.28 47.53,40.7 ESP2.8
N$43
  Top 0.305: ESP2.22 61.75,23.97 62.56,23.16 63.07,23.16 64.42,21.81 SJ24.1
N$44
  Top 0.305: ESP2.21 59.75,23.99 61.93,21.81 SJ25.1
N$45
  Top 0.305: ESP2.18 53.9,24.48 53.9,22.01 54.46,22.01 SJ26.1
N$46
  Top 0.305: ESP2.17 51.75,21.98 SJ27.1
N$47
  Top 0.305: ESP2.19 55.75,22.98 56.92,21.81 SJ28.1
N$48
  Top 0.305: ESP2.20 57.75,23.4 59.34,21.81 SJ29.1
N$49
  Top 0.305: ESP2.2 59.75,41.02 61.88,43.15 SJ30.1
N$67
  Top 0.305: ESP2.6 51.92,40.65 SJ19.2
N$68
  Top 0.305: ESP2.7 49.38,40.85 SJ20.2
N$69
  Top 0.305: ESP2.5 53.95,40.68 53.95,42.84 54.26,43.15 SJ21.2
N$70
  Top 0.305: ESP2.16 49.75,22.18 SJ22.2
N$71
  Top 0.305: ESP2.4 55.75,42.07 56.82,43.15 SJ23.2
N$91  (via drill 0.6)
  Top 0.305: RD1.1 RD2.2 60.66,77.22 63.96,73.92 v64.59,73.92 | IC6.P$2 64.44,68 v64.52,67.93
  Bottom 0.305: v64.59,73.92 64.52,73.84 v64.52,67.93
N$92
  Top 0.305: IC6.P$6 59.3,71.15 C3.2
OUTA  (via drill 0.6)
  Top 0.305: IC2.25 24.38,66.52 | 24.38,66.52 25.31,66.52 | 25.31,66.52 25.31,64.52 | 25.48,64.27 IC2.OUTA 25.31,64.52 | 17.83,60.42 18.09,60.42 | 18.36,60.42 19.81,60.42 IC2.30 | 24.38,66.52 24.38,66.55 v24.28,65.54 v24.28,59.44 | 25.31,66.52 27.33,66.52 v26.31,63.51 | v26.31,61.47 25.31,64.52 | v24.28,63.51 v24.28,61.47 v22.25,59.44 | v26.31,61.47 v26.31,59.44 | 25.31,64.52 v24.28,63.51 | v24.28,63.51 24.38,64.52 24.38,64.78 | v24.28,63.51 v26.31,61.47
  Top 0.406: v26.31,65.54 24.38,66.55 24.38,64.78
  Top 2.54: v24.28,61.47 25.3,60.69 27.1,60.69 27.1,60.42 18.36,60.42 18.09,60.42 16.21,60.42 J5.1
  other vias: 22.25,57.41 20.22,59.44 20.22,57.41 24.28,57.41 26.31,57.41 26.31,55.38 24.28,55.38 22.25,55.38 20.22,55.38 26.31,53.35 24.28,53.35 22.25,53.35 20.22,53.35 20.22,51.31 22.25,51.31 24.28,51.31 26.31,51.31
  pour Top: 22.3,66.91 28.32,66.91 28.32,48.98 20.32,48.98 18.87,50.42 18.87,61.7 22.3,61.7
  pour Bottom: 22.28,66.91 28.35,66.91 28.35,48.98 20.32,48.98 18.87,50.42 18.87,60.94 20.37,60.94 22.28,62.85
OUTB  (via drill 0.6)
  Top 0.305: 31.56,76.78 37.59,76.78 37.81,76.78 | 25.31,74.56 IC2.OUTB | IC2.21 22.35,70.52 24.38,70.52 | 24.38,70.52 25.3,70.52 | IC2.OUTB 25.31,70.52 25.3,70.52 | 18.57,76.78 19.81,76.78 IC2.16 | 38.13,76.78 37.81,76.78 | 37.81,76.78 IC2.15 | 24.66,75.21 24.66,74.56 v23.27,76.59 v24.28,73.54 | v26.31,75.57 v27.33,76.59 v25.3,76.59 25.3,70.52 | v24.28,75.57 26.42,72.52 26.42,72.9 25.31,72.9 IC2.OUTB | v24.28,71.51 24.38,70.49 24.38,70.52 | v26.31,71.51 v26.31,73.54
  Top 0.406: v26.31,71.51 22.35,70.49 22.35,70.52 | v37.49,76.59 37.59,76.59 37.59,76.78 | v35.46,76.59 v33.43,76.59 v31.39,76.59 | v31.39,76.59 v29.36,76.59 | v21.23,76.59 v19.2,76.59 20.32,76.59 20.32,76.78 | v31.39,76.59 31.55,76.59 31.55,76.78
  Top 2.54: 25.31,74.56 24.66,75.21 23.09,76.78 | 23.09,76.78 20.32,76.78 18.57,76.78 12.89,71.09 J5.2 | 23.09,76.78 31.55,76.78 37.59,76.78 38.13,76.78
  pour Bottom: 19.13,70.14 28.32,70.11 28.32,75.49 41.1,75.49 41.1,78.59 15.75,78.59 15.75,75.27 19.13,75.29
PEL_INA  (via drill 0.6)
  Top 0.305: v56.13,62.62 56.3,62.78 SJ38.3 | R1.1 45.21,65.54 46.23,64.52 47.42,64.52 48.54,63.4 48.54,59.98 48.78,59.74 SJ39.1 51.57,59.74 v51.82,59.49
  Bottom 0.305: v56.13,62.62 53.01,59.49 v51.82,59.49
PEL_INB  (via drill 0.6)
  Top 0.305: SJ26.2 v54.46,17.74 55.8,16.4 v55.8,14.15 55.8,13.95 55.8,10.11 55.04,9.35 53.11,9.35 51.68,7.92 IO0.4 | R2.1 43.28,70.52 v44.6,70.52
  Top 1.27: IO0.1 IO0.4
  Bottom 0.305: SJ7.1 65.84,45.94 65.99,45.79 65.99,43.88 67.47,42.41 67.47,41.44 64.39,38.37 55.6,38.37 52.88,35.65 52.88,29.73 45.29,22.14 45.29,16.59 46.99,14.89 53.24,14.89 54.46,16.11 v54.46,17.74 | v44.6,70.52 43.59,69.5 43.59,16.03 46.41,13.21 54.86,13.21 v55.8,14.15
PEL_PWM  (via drill 0.5, 0.6)
  Top 0.305: SJ28.2 56.59,19.88 v56.59,17.7 | v44.45,68.08 R3.1
  Bottom 0.305: SJ14.2 65.56,18.08 65.56,17.31 65.1,16.86 63.33,16.86 62.72,16.25 61.5,16.25 61.14,16.6 59.26,16.6 58.88,16.98 58.17,16.98 57.46,17.7 v56.59,17.7 56.59,16.57 53.77,13.75 46.63,13.75 44.09,16.29 44.09,67.72 v44.45,68.08
RESET  (via drill 0.6)
  Top 0.305: SJ15.1 v64.62,48.38 64.62,49.67 64.59,49.7 | 36.02,6.99 36.17,6.84 | v47.27,17.18 47.27,9.45 46.3,8.49 43.33,8.49 RST.4
  Top 0.406: R9.2 32.53,18.48 33.2,17.81 33.2,15.07 35.92,12.35 35.92,8.44 RST.1
  Top 1.27: RST.1 36.17,6.84 RST.4
  Bottom 0.305: SJ10.2 54.38,19.02 51.6,16.24 49.89,16.24 49,17.13 47.32,17.13 v47.27,17.18 | v64.62,48.38 65.69,48.38 67.74,46.32 67.74,44.64 69.17,43.22 69.17,40.83 64.92,36.59 56.37,36.59 54.51,34.74 54.51,29.12 46.91,21.53 46.91,17.53 v47.27,17.18 | v47.27,17.18 47.3,17.18
RXD  (via drill 0.6)
  Top 0.305: SJ25.2 v62.08,17.67 62.08,16.23 68.12,10.19 SERIAL.2
  Bottom 0.305: 61.75,18.81 61.88,18.81 SJ13.2 v62.08,17.67
SPI_CS
  Top 0.305: 54.39,59.74 SJ40.1 53.26,58.88 53.26,53.45 53.57,53.14 56.26,53.14 56.85,53.73 IC5.7
SPI_SCK
  Top 0.305: 61.95,59.53 SJ37.1 60.14,59.74 59.61,59.21 59.61,56.57 IC5.5
SPI_SDO
  Top 0.305: SJ38.1 56.58,59.74 55.32,58.48 54.25,58.48 53.82,58.05 53.82,53.91 53.98,53.75 56.01,53.75 56.67,54.41 57.4,54.41 57.99,55 IC5.6
SPI_WELL_TEMP
  Top 0.305: IC5.2 66.37,53.73 66.73,54.08 66.73,58.7 65.69,59.74 SJ17.1
TXD  (via drill 0.6)
  Top 0.305: SJ24.2 v64.62,17.62 64.62,14.74 66.63,12.73 SERIAL.3
  Bottom 0.305: SJ12.2 61.7,16.86 62.46,16.86 63.22,17.62 v64.62,17.62
WELL_TEMP
  Top 0.305: SJ17.2 67.68,61.26 68.61,62.19 68.61,71.33 66.88,73.06 63.75,73.06 60.35,76.46 55.37,76.46 RL.1 RH2.2 RH1.2 46.2,77.22 45.21,76.23 WELL_TEMP.1

### Text on the board
tPlace: WELL_TEMP | J1 | High / Precision | BLACK | PELTIER | J5 | I2C | RED | SPI | HEATER_TEMP | J4 | HEATER | Q2 | Q3 | ESP-12F | J3 | FAN | JP2 | NinjaPCB ver2-170831
bPlace: ESP-WROOM-02 | GND | TX | RX | NinjaPCB ver2-170831